# Altium schematic sheet 08_CAN_Interface.SchDoc: Mainboard CAN
size A3; SheetNumber: 12; SheetTotal: 13
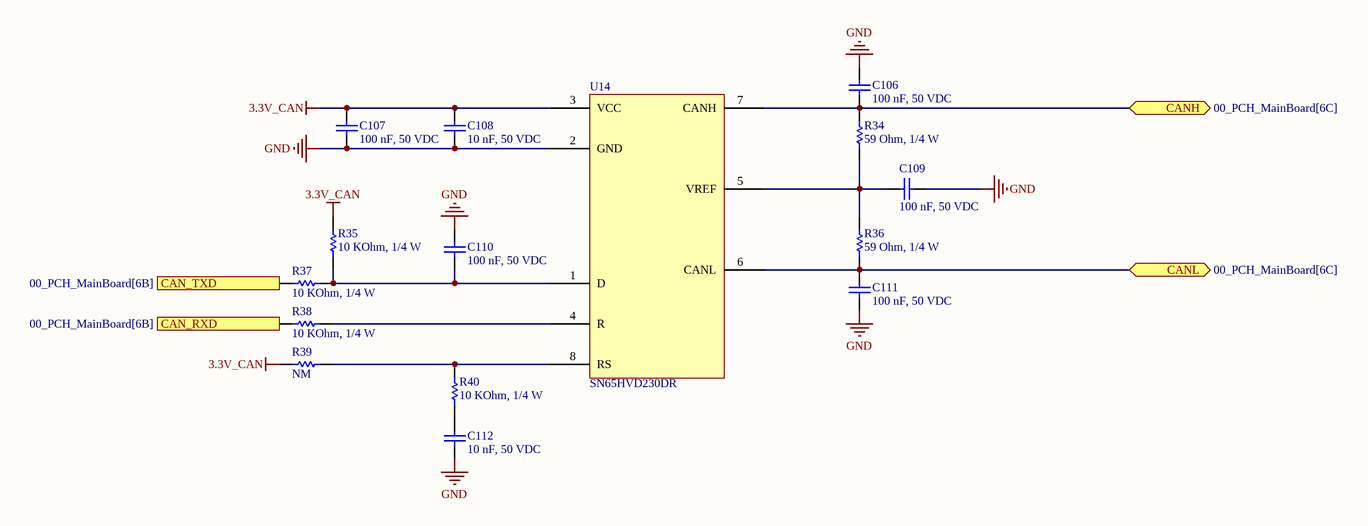
[diagram p0: 08_CAN_Interface.SchDoc]

## Parts
C106  100 nF, 50 VDC  [CAP_0603]
C107  100 nF, 50 VDC  [CAP_0603]
C108  10 nF, 50 VDC  [CAP_0603]
C109  100 nF, 50 VDC  [CAP_0603]
C110  100 nF, 50 VDC  [CAP_0603]
C111  100 nF, 50 VDC  [CAP_0603]
C112  10 nF, 50 VDC  [CAP_0603]
R34  59 Ohm, 1/4 W  [resistor_0603]
R35  10 KOhm, 1/4 W  [resistor_0603]
R36  59 Ohm, 1/4 W  [resistor_0603]
R37  10 KOhm, 1/4 W  [resistor_0603]
R38  10 KOhm, 1/4 W  [resistor_0603]
R39  NM  [resistor_0603]
R40  10 KOhm, 1/4 W  [resistor_0603]
U14  SN65HVD230DR  [SN65HVD230]

## Ports
CAN_RXD (out, see 00_PCH_MainBoard[6B]), CAN_TXD (in, see 00_PCH_MainBoard[6B]), CANH (bidir, see 00_PCH_MainBoard[6C]), CANL (bidir, see 00_PCH_MainBoard[6C])

## Nets
3.3V_CAN: C107.2 C108.2 R35.1 R39.1 U14.3(VCC)
GND: C106.2 C107.1 C108.1 C109.2 C110.2 C111.1 C112.1 U14.2(GND)
CAN_RXD: R38.1 ; port CAN_RXD
CAN_TXD: R37.1 ; port CAN_TXD
CANH: C106.1 R34.2 U14.7(CANH) ; port CANH
CANL: C111.2 R36.1 U14.6(CANL) ; port CANL
NetC109_1: C109.1 R34.1 R36.2 U14.5(VREF)
NetC110_1: C110.1 R35.2 R37.2 U14.1(D)
NetC112_2: C112.2 R40.1
NetR38_2: R38.2 U14.4(R)
NetR39_2: R39.2 R40.2 U14.8(RS)

## Notes on the sheet
- APPROVALS
- DATE
- PROJECT
- BOM:
- REFERENCE DOCUMENTS
- TITLE
- PROJECT REVISION
- DOCUMENT REVISION
- ASSY DWG:
- FAB DWG:
- PCB DWG:
- SIZE:
- A3
- FILE NAME:
- REV
- SHEET
- OF

## Library data of the parts
C106 C107 C109-C111 = 0106031041050: CAP, size 0603, 100 nF, 50 VDC; Manufacture Name: TDK; Manufacture SN: CGA3E3X8R1H104K080AE; Capacitance: 100 nF; Tolerance: +/-10%; Voltage Rating DC: 50 VDC; ComponentLink2Description: Datasheet; ComponentLink2URL: https://product.tdk.com/system/files/dam/doc/product/capacitor/ceramic/mlcc/catalog/mlcc_automotive_soft_en.pdf?ref_disty=mouser; Operating Temperature: -55 to +125degC; Packaging: Tape and Reel; Mounting Technology: SMT; Size: 0603; Supplier 1 Name: Mouser; Supplier 1 SN: 810-CGA3E3X8R1H104KA; Supplier 1 URL: https://www.mouser.com/ProductDetail/TDK/CGA3E3X8R1H104K080AE?qs=nQSIdc08i%252Bd8g3IRRgU2bw%3D%3D&utm_source=mouser-refine-download&utm_medium=file&utm_campaign=CGA3E3X8R1H104K080AE&utm_content=TDK; Supplier 2 Name: Digi-Key; Supplier 2 SN: 445-173697-2-ND; Supplier 2 URL: https://www.digikey.com/en/products/detail/tdk-corporation/cga3e3x8r1h104k080ae/5809262; Supplier 3 Name: thegioiic; Supplier 3 SN: N/A; Supplier 3 URL: N/A; Value: 100 nF, 50 VDC
C108 C112 = 0106031030550: CAP, size 0603, 10 nF, 50 VDC; Manufacture Name: TDK; Manufacture SN: CGA3E2C0G1H103J080AE; Capacitance: 10 nF; Tolerance: +/-5%; Voltage Rating DC: 50 VDC; ComponentLink2Description: Datasheet; ComponentLink2URL: https://product.tdk.com/system/files/dam/doc/product/capacitor/ceramic/mlcc/catalog/mlcc_automotive_soft_en.pdf?ref_disty=mouser; Operating Temperature: -55 to +125degC; Packaging: Tape and Reel; Mounting Technology: SMT; Size: 0603; Supplier 1 Name: Mouser; Supplier 1 SN: 810-CGA3E2C0G1H103J8; Supplier 1 URL: https://www.mouser.com/ProductDetail/TDK/CGA3E2C0G1H103J080AE?qs=P1JMDcb91o6ZkMITrWTUZQ%3D%3D&utm_source=mouser-refine-download&utm_medium=file&utm_campaign=CGA3E2C0G1H103J080AE&utm_content=TDK; Supplier 2 Name: Digi-Key; Supplier 2 SN: 445-CGA3E2C0G1H103J080AETR-ND; Supplier 2 URL: https://www.digikey.com/en/products/detail/tdk-corporation/cga3e2c0g1h103j080ae/11697946; Supplier 3 Name: thegioiic; Supplier 3 SN: N/A; Supplier 3 URL: N/A; Value: 10 nF, 50 VDC
R34 R36 = 0006035901: RES, size 0603, 59 Ohm, 1/4 W; Manufacture  Name: OEM; Resistance: 59 Ohm; Rated Power: 1/4 W; Resistance Tolerance: +/-1%; Size: 0603; Mounting Technology: SMT; Supplier 1 Name: Mouser; Supplier 1 SN: 71-RCS060359R0FKEA; Supplier 2 Name: Digi-Key; Supplier 2 SN: 541-10480-2-ND 541-10480-1-ND 541-10480-6-ND; Supplier 1 URL: https://www.mouser.vn/ProductDetail/Vishay-Dale/RCS060359R0FKEA?qs=sGAEpiMZZMvdGkrng054txfS%2FhNqc3c5%2Fx%2FP%252BWnZoLzaz8jeQEqAIA%3D%3D; Supplier 3 Name: thegioiic; Supplier 3 SN: N/A; Supplier 3 URL: N/A; Manufacture  SN: OEM; Value: 59 Ohm, 1/4 W; ComponentLink1Description: Datasheet link; ComponentLink1URL: https://www.vishay.com/docs/20065/rcse3.pdf; ComponentLink2Description: Supplier 1 URL; ComponentLink2URL: N/A; ComponentLink3Description: Supplier 2 URL; ComponentLink3URL: https://www.digikey.com/en/products/detail/vishay-dale/RCS060359R0FKEA/5868349; ComponentLink4Description: Supplier 3 URL; ComponentLink4URL: N/A; Supplier 2 URL: https://www.digikey.com/en/products/detail/vishay-dale/RCS060359R0FKEA/5868349
R35 R37 R38 R40 = 0006031031: RES, size 0603, 10 KOhm, 1/4 W; Manufacture  Name: OEM; Resistance: 10 KOhm; Rated Power: 1/4 W; Resistance Tolerance: +/-1%; Size: 0603; Mounting Technology: SMT; Supplier 1 Name: Mouser; Supplier 1 SN: 755-ESR03EZPF1002; Supplier 2 Name: Digi-Key; Supplier 2 SN: RHM10KADTR-ND RHM10KADCT-ND RHM10KADDKR-ND; Supplier 1 URL: https://www.mouser.vn/ProductDetail/ROHM-Semiconductor/ESR03EZPF1002?qs=sGAEpiMZZMvdGkrng054t67Efho1F8r6CDeAsqwFse8%3D; Supplier 3 Name: thegioiic; Supplier 3 SN: N/A; Supplier 3 URL: N/A; Manufacture  SN: OEM; Value: 10 KOhm, 1/4 W; ComponentLink1Description: Datasheet link; ComponentLink1URL: https://fscdn.rohm.com/en/products/databook/datasheet/passive/resistor/chip_resistor/esr-e.pdf; ComponentLink2Description: Supplier 1 URL; ComponentLink2URL: N/A; ComponentLink3Description: Supplier 2 URL; ComponentLink3URL: https://www.digikey.com/en/products/detail/rohm-semiconductor/ESR03EZPF1002/1983429; ComponentLink4Description: Supplier 3 URL; ComponentLink4URL: N/A; Supplier 2 URL: https://www.digikey.com/en/products/detail/rohm-semiconductor/ESR03EZPF1002/1983429
R39 = 000603_NM: RES, size 0603, NM; Resistance: NM; Size: 0603; Rated Power: N/A; Mounting Technology: SMT; Supplier 1 Name: Mouser; Supplier 1 SN: N/A; Supplier 2 Name: Digi-Key; Supplier 2 SN: N/A; Supplier 1 URL: N/A; Supplier 3 Name: thegioiic; Supplier 3 SN: N/A; Supplier 3 URL: N/A; Manufacture  Name: N/A; Manufacture  SN: N/A; Value: NM; ComponentLink1Description: Datasheet link; ComponentLink1URL: N/A; ComponentLink2Description: Supplier 1 URL; ComponentLink2URL: N/A; ComponentLink3Description: Supplier 2 URL; ComponentLink3URL: N/A; ComponentLink4Description: Supplier 3 URL; ComponentLink4URL: N/A; Resistance Tolerance: N/A; Supplier 2 URL: N/A
U14 = SN65HVD230DR: CAN Interface IC STANDBY MODE; Manufacturer: Texas Instruments; Active Read Current - Max: Active; Supply Voltage: 3.1 V - 3.6 V; Data Rate: 1 Mb/s; Number of Drivers: 1; ComponentLink1Description: Datasheet link; ComponentLink1URL: https://www.ti.com/general/docs/suppproductinfo.tsp?distId=26&gotoUrl=https://www.ti.com/lit/gpn/sn65hvd230; ComponentLink2Description: Supplier 1 URL; ComponentLink2URL: https://www.mouser.com/ProductDetail/Texas-Instruments/SN65HVD230DR?qs=QViXGNcIEAtifeQR3pYVUQ%3D%3D; ComponentLink3Description: Supplier 2 URL; ComponentLink3URL: https://www.digikey.com/en/products/detail/texas-instruments/SN65HVD230DR/404367; ComponentLink4Description: thegioiic; ComponentLink4URL: https://www.thegioiic.com/sn65hvd230dr-can-transceiver-8-soic; Manufacturer SN: SN65HVD230DR; Mounting Style: SMD/SMT; Package: SOIC-8; Supplier 1 Name: Mouser; Supplier 1 SN: 595-SN65HVD230DR; Supplier 1 URL: https://www.mouser.com/ProductDetail/Texas-Instruments/SN65HVD230DR?qs=QViXGNcIEAtifeQR3pYVUQ%3D%3D; Supplier 2 Name: Digi-Key; Supplier 2 SN: 296-11654-2-ND; Supplier 2 URL: https://www.digikey.com/en/products/detail/texas-instruments/SN65HVD230DR/404367; Supplier 3 Name: thegioiic; Supplier 3 SN: SN65HVD230DR; Supplier 3 URL: https://www.thegioiic.com/sn65hvd230dr-can-transceiver-8-soic; Value: SN65HVD230DR; Number of Receivers: 1